# Altium schematic sheet balancer.SchDoc
size A
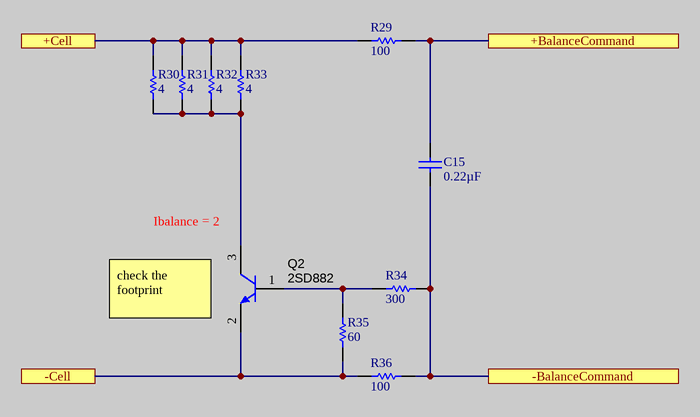
[diagram p0: balancer.SchDoc]

## Parts
C15  0.22µF  [CAPC0603]
Q2  2SD882  [dpak]
R29  100  [RESC0603]
R30  4  [RES2512]
R31  4  [RES2512]
R32  4  [RES2512]
R33  4  [RES2512]
R34  300  [RESC0603]
R35  60  [RESC0603]
R36  100  [RESC0603]

## Ports
+BalanceCommand, +Cell, -BalanceCommand, -Cell

## Nets
+BalanceCommand: C15.2 R29.2 ; port +BalanceCommand
+Cell: R29.1 R30.1 R31.1 R32.1 R33.1 ; port +Cell
-BalanceCommand: C15.1 R34.2 R36.2 ; port -BalanceCommand
-Cell: Q2.2(E) R35.1 R36.1 ; port -Cell
NetQ2_1: Q2.1(B) R34.1 R35.2
NetQ2_3: Q2.3(C) R30.2 R31.2 R32.2 R33.2

## Notes on the sheet
- (near Q2) Ibalance = 2
- (near Q2) check the footprint

## Library data of the parts
C15 = Capacitor: Published: 8-Jun-2000; LatestRevisionDate: 17-Jul-2002; LatestRevisionNote: Re-released for DXP Platform.; PackageReference: C0805; Publisher: Altium Limited; Value: 0.22µF
Q2 = BSR14, Nexperia: BJT 30V 3A 40V 10W SI-NPN; PartNumber: BSR14; U/M: EA; Value1: 0.8 A; Value2: 300; SizeAreaWB_mm2: 14; SizeArea_mm2: 7.5; SizeX_mm: 2.5; SizeY_mm: 3; SizeZ_mm: 1.1; AEC Category: Q101; PNP: 0; NPN: 1; Vceo_V: 40; Vcesat1_V: 0.3; IcRated_A: 0.8; TaMin_C: -65; TaMax_C: 150; SymbolVersion: 2008-07-31; CompType: BJT; Manufacturer: Nexperia; PackageReference: SOT-23; Value: 40 V; RoHS: Y; MountType: SMT; Published: 2008-07-31; Publisher: Texas Instruments; LatestRevisionDate: 2017-06-09; ComponentLink1Description: Datasheet link; ComponentLink1URL: http://www.nexperia.com/documents/data_sheet/BSR13_BSR14.pdf; Supplier 1: Digi-Key; Supplier Part Number 1: 568-6225-1-ND; AEC Qualified: ?; HfeMax: 300
R29-R36 = Resistor: 0603,0.1W; Published: 8-Jun-2000; LatestRevisionDate: 17-Jul-2002; LatestRevisionNote: Re-released for DXP Platform.; PackageReference: AXIAL-0.5; Publisher: Altium Limited
  R29 R36: Value: 100
  R30-R33: Value: 4
  R34: Value: 300
  R35: Value: 60